# EAGLE board robot_PI4_F28379D (EAGLE 7.7.0), part 1 of 2
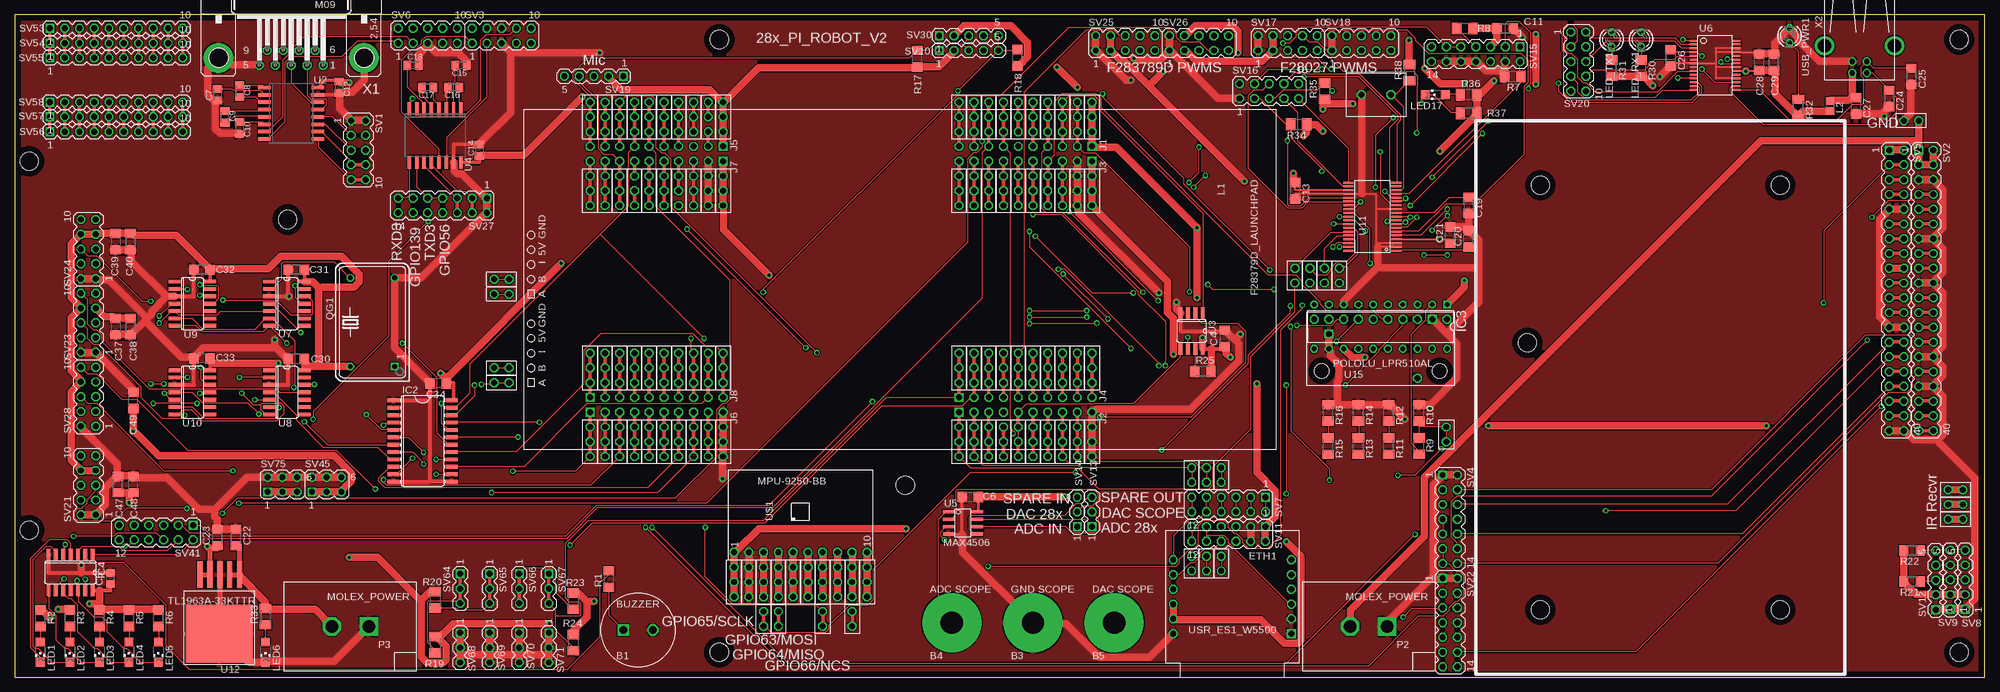
[diagram p6: board, top side]
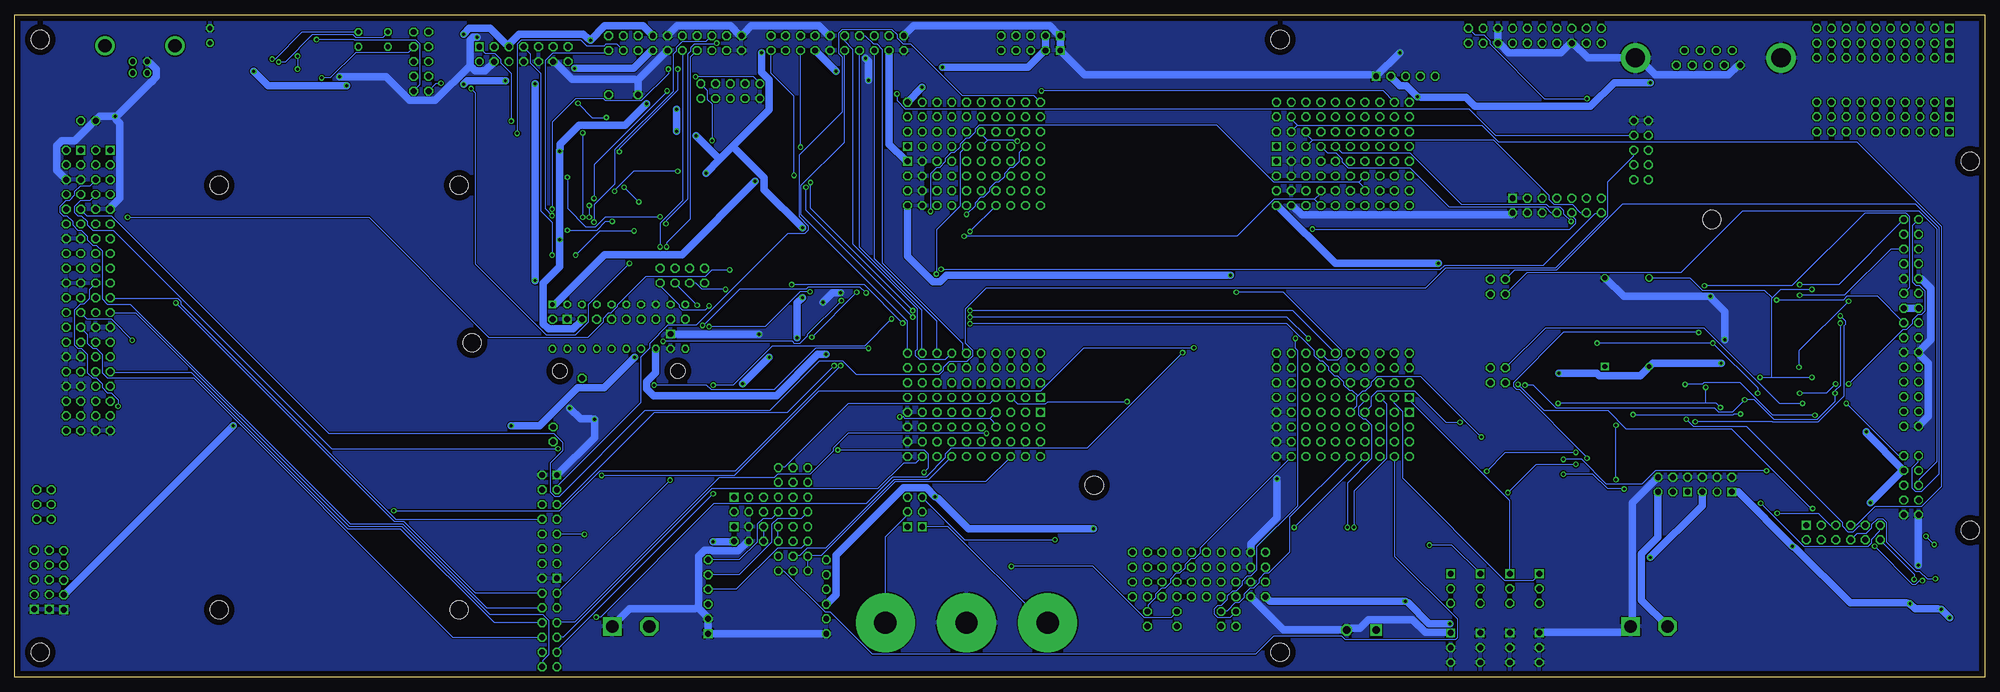
[diagram p7: board, bottom side, seen from below]

Size 339.07 x 113.97 mm. Coordinates in mm from the lower left corner, seen from the top.
Outline: 0,0 339.07,0 339.07,113.97 0,113.97 0,0
Copper layers (1*16): Top 0.035mm / dielectric 1.5mm / Bottom 0.035mm
Design rules "default *": minimum track width 8mil, minimum drill 20mil, track to track 8mil, track to pad 8mil, pad to pad 8mil, via to via 8mil, smd to smd 8mil, copper to edge 40mil, drill to drill 8mil, minimum pad ring 10mil, minimum via ring 8mil, stop-mask expansion 4mil, vias tented up to drill 20mil, thermal gap 10mil
Net classes: 0 default: width 0.203 mm, drill 0.508 mm, clearance 0.203 mm; 1 supply: width 1.27 mm, drill 0.508 mm, clearance 0.203 mm
Holes 3.17 mm at 121.28,4.28 334.64,4.28 334.64,109.69 121.28,109.69 2.53,88.73 2.53,25.23 46.98,78.7 260.34,57.49 153.28,32.98 262.57,84.61 303.84,84.61 303.84,11.58 262.57,11.58

## Footprints (pad centres in the part's own frame; a part is rotated, then mirrored left to right if it is on the bottom)
BUZZER = drill 1.27 square: P$1 -2.54,0 | drill 1.27 octagon: P$2 2.54,0
BANANA_MALE = drill 3.81 pad 10.16: P$1 0,0
C1206 = smd 1.6 x 1.8: 1 -1.4,0; 2 1.4,0
C0805 = smd 1.3 x 1.5: 1 -0.95,0; 2 0.95,0
C0805K = smd 1.3 x 1.6: 1 -1,0; 2 1,0
USR_ES1_W5500 = drill 1.016 square: P$1 0,0 | drill 1.016 octagon: P$2 0,-2.54; P$3 0,-5.08; P$4 0,-7.62; P$5 0,-10.16; P$6 0,-12.7; P$7 20.32,-12.7; P$8 20.32,-10.16; P$9 20.32,-7.62; P$10 20.32,-5.08; P$11 20.32,-2.54; P$12 20.32,0
SO24W = smd 0.66 x 2.032: 1 -6.985,-5.029; 2 -5.715,-5.029; 3 -4.445,-5.029; 4 -3.175,-5.029; 5 -1.905,-5.029; 6 -0.635,-5.029; 7 0.635,-5.029; 8 1.905,-5.029; 9 3.175,-5.029; 10 4.445,-5.029; 11 5.715,-5.029; 12 6.985,-5.029; 13 6.985,5.029; 14 5.715,5.029; 15 4.445,5.029; 16 3.175,5.029; 17 1.905,5.029; 18 0.635,5.029; 19 -0.635,5.029; 20 -1.905,5.029; 21 -3.175,5.029; 22 -4.445,5.029; 23 -5.715,5.029; 24 -6.985,5.029
DIL20 = drill 0.813 square: 1 -11.43,-3.81 | drill 0.813 octagon: 2 -8.89,-3.81; 3 -6.35,-3.81; 4 -3.81,-3.81; 5 -1.27,-3.81; 6 1.27,-3.81; 7 3.81,-3.81; 8 6.35,-3.81; 9 8.89,-3.81; 10 11.43,-3.81; 11 11.43,3.81; 12 8.89,3.81; 13 6.35,3.81; 14 3.81,3.81; 15 1.27,3.81; 16 -1.27,3.81; 17 -3.81,3.81; 18 -6.35,3.81; 19 -8.89,3.81; 20 -11.43,3.81
SO14 = smd 0.66 x 2.032: 1 -3.81,-3.073; 2 -2.54,-3.073; 3 -1.27,-3.073; 4 0,-3.073; 5 1.27,-3.073; 6 2.54,-3.073; 7 3.81,-3.073; 8 3.81,3.073; 9 2.54,3.073; 10 1.27,3.073; 11 0,3.073; 12 -1.27,3.073; 13 -2.54,3.073; 14 -3.81,3.073
STRIP2 = drill 1.016 octagon: P$1 0,0; P$2 2.54,0
STRIP3 = drill 1.016 octagon: P$1 0,0; P$2 2.54,0; P$3 5.08,0
F28379D_LAUNCHPAD = drill 1.016 square: P$1 -24.13,33.02; P$11 21.59,10.16; P$21 -21.59,33.02; P$31 19.05,10.16; P$41 -24.13,-30.48; P$51 21.59,-53.34; P$61 -21.59,-30.48; P$71 19.05,-53.34 | drill 1.016 octagon: P$2 -24.13,30.48; P$3 -24.13,27.94; P$4 -24.13,25.4; P$5 -24.13,22.86; P$6 -24.13,20.32; P$7 -24.13,17.78; P$8 -24.13,15.24; P$9 -24.13,12.7; P$10 -24.13,10.16; P$12 21.59,12.7; P$13 21.59,15.24; P$14 21.59,17.78; P$15 21.59,20.32; P$16 21.59,22.86; P$17 21.59,25.4; P$18 21.59,27.94; P$19 21.59,30.48; P$20 21.59,33.02; P$22 -21.59,30.48; P$23 -21.59,27.94; P$24 -21.59,25.4; P$25 -21.59,22.86; P$26 -21.59,20.32; P$27 -21.59,17.78; P$28 -21.59,15.24; P$29 -21.59,12.7; P$30 -21.59,10.16; P$32 19.05,12.7; P$33 19.05,15.24; P$34 19.05,17.78; P$35 19.05,20.32; P$36 19.05,22.86; P$37 19.05,25.4; P$38 19.05,27.94; P$39 19.05,30.48; P$40 19.05,33.02; P$42 -24.13,-33.02; P$43 -24.13,-35.56; P$44 -24.13,-38.1; P$45 -24.13,-40.64; P$46 -24.13,-43.18; P$47 -24.13,-45.72; P$48 -24.13,-48.26; P$49 -24.13,-50.8; P$50 -24.13,-53.34; P$52 21.59,-50.8; P$53 21.59,-48.26; P$54 21.59,-45.72; P$55 21.59,-43.18; P$56 21.59,-40.64; P$57 21.59,-38.1; P$58 21.59,-35.56; P$59 21.59,-33.02; P$60 21.59,-30.48; P$62 -21.59,-33.02; P$63 -21.59,-35.56; P$64 -21.59,-38.1; P$65 -21.59,-40.64; P$66 -21.59,-43.18; P$67 -21.59,-45.72; P$68 -21.59,-48.26; P$69 -21.59,-50.8; P$70 -21.59,-53.34; P$72 19.05,-50.8; P$73 19.05,-48.26; P$74 19.05,-45.72; P$75 19.05,-43.18; P$76 19.05,-40.64; P$77 19.05,-38.1; P$78 19.05,-35.56; P$79 19.05,-33.02; P$80 19.05,-30.48
L0805 = smd 1.3 x 1.5: 1 -0.85,0; 2 0.85,0
CHIPLED_1206 = smd 1.5 x 1.5: A 0,-1.75; C 0,1.75
LED3MM = drill 0.813 octagon: A -1.27,0; K 1.27,0
TH_PUSHBUTTON = drill 1.016 octagon: 1 0,2.54; 2 0,-2.54
MOLEX_POWER = drill 2.159 square: P$1 0,0 | drill 2.159 octagon: P$2 6.35,0
DIL14S = drill 0.813 square: 1 -7.62,-3.81 | drill 0.813: 7 7.62,-3.81; 8 7.62,3.81; 14 -7.62,3.81
R1206 = smd 1.6 x 1.803: 1 -1.422,0; 2 1.422,0
M1206 = smd 1.6 x 2: 1 -1.4,0; 2 1.4,0
MA05-2 = drill 1.016 octagon: 1 -5.08,-1.27; 2 -5.08,1.27; 3 -2.54,-1.27; 4 -2.54,1.27; 5 0,-1.27; 6 0,1.27; 7 2.54,-1.27; 8 2.54,1.27; 9 5.08,-1.27; 10 5.08,1.27
MA20-2 = drill 1.016 square: 1 -24.13,-1.27 | drill 1.016 octagon: 2 -24.13,1.27; 3 -21.59,-1.27; 4 -21.59,1.27; 5 -19.05,-1.27; 6 -19.05,1.27; 7 -16.51,-1.27; 8 -16.51,1.27; 9 -13.97,-1.27; 10 -13.97,1.27; 11 -11.43,-1.27; 12 -11.43,1.27; 13 -8.89,-1.27; 14 -8.89,1.27; 15 -6.35,-1.27; 16 -6.35,1.27; 17 -3.81,-1.27; 18 -3.81,1.27; 19 -1.27,-1.27; 20 -1.27,1.27; 21 1.27,-1.27; 22 1.27,1.27; 23 3.81,-1.27; 24 3.81,1.27; 25 6.35,-1.27; 26 6.35,1.27; 27 8.89,-1.27; 28 8.89,1.27; 29 11.43,-1.27; 30 11.43,1.27; 31 13.97,-1.27; 32 13.97,1.27; 33 16.51,-1.27; 34 16.51,1.27; 35 19.05,-1.27; 36 19.05,1.27; 37 21.59,-1.27; 38 21.59,1.27; 39 24.13,-1.27; 40 24.13,1.27
MA07-2 = drill 1.016 square: 1 -7.62,-1.27 | drill 1.016 octagon: 2 -7.62,1.27; 3 -5.08,-1.27; 4 -5.08,1.27; 5 -2.54,-1.27; 6 -2.54,1.27; 7 0,-1.27; 8 0,1.27; 9 2.54,-1.27; 10 2.54,1.27; 11 5.08,-1.27; 12 5.08,1.27; 13 7.62,-1.27; 14 7.62,1.27
MA06-2 = drill 1.016 square: 1 -6.35,-1.27 | drill 1.016 octagon: 2 -6.35,1.27; 3 -3.81,-1.27; 4 -3.81,1.27; 5 -1.27,-1.27; 6 -1.27,1.27; 7 1.27,-1.27; 8 1.27,1.27; 9 3.81,-1.27; 10 3.81,1.27; 11 6.35,-1.27; 12 6.35,1.27
MA05-1 = drill 1.016 square: 1 -5.08,0 | drill 1.016 octagon: 2 -2.54,0; 3 0,0; 4 2.54,0; 5 5.08,0
MA03-1 = drill 1.016 square: 1 -2.54,0 | drill 1.016 octagon: 2 0,0; 3 2.54,0
MA03-2 = drill 1.016 square: 1 -2.54,-1.27 | drill 1.016 octagon: 2 -2.54,1.27; 3 0,-1.27; 4 0,1.27; 5 2.54,-1.27; 6 2.54,1.27
MA10-1 = drill 1.016 square: 1 -11.43,0 | drill 1.016 octagon: 2 -8.89,0; 3 -6.35,0; 4 -3.81,0; 5 -1.27,0; 6 1.27,0; 7 3.81,0; 8 6.35,0; 9 8.89,0; 10 11.43,0
SO16W = smd 0.6 x 2.2: 1 -4.445,-4.6; 2 -3.175,-4.6; 3 -1.905,-4.6; 4 -0.635,-4.6; 5 0.635,-4.6; 6 1.905,-4.6; 7 3.175,-4.6; 8 4.445,-4.6; 9 4.445,4.6; 10 3.175,4.6; 11 1.905,4.6; 12 0.635,4.6; 13 -0.635,4.6; 14 -1.905,4.6; 15 -3.175,4.6; 16 -4.445,4.6
SO08 = smd 0.66 x 2.032: 1 -1.905,-3.073; 2 -0.635,-3.073; 3 0.635,-3.073; 4 1.905,-3.073; 5 1.905,3.073; 6 0.635,3.073; 7 -0.635,3.073; 8 -1.905,3.073
SOIC-8 = smd 1.98 x 0.53: P$1 -2.465,1.905; P$2 -2.465,0.635; P$3 -2.465,-0.635; P$4 -2.465,-1.905; P$5 2.465,-1.905; P$6 2.465,-0.635; P$7 2.465,0.635; P$8 2.465,1.905
SSOP28DB = smd 0.348 x 1.397: 1 -4.225,-3.656; 2 -3.575,-3.656; 3 -2.925,-3.656; 4 -2.275,-3.656; 5 -1.625,-3.656; 6 -0.975,-3.656; 7 -0.325,-3.656; 8 0.325,-3.656; 9 0.975,-3.656; 10 1.625,-3.656; 11 2.275,-3.656; 12 2.925,-3.656; 13 3.575,-3.656; 14 4.225,-3.656; 15 4.225,3.656; 16 3.575,3.656; 17 2.925,3.656; 18 2.275,3.656; 19 1.625,3.656; 20 0.975,3.656; 21 0.325,3.656; 22 -0.325,3.656; 23 -0.975,3.656; 24 -1.625,3.656; 25 -2.275,3.656; 26 -2.925,3.656; 27 -3.575,3.656; 28 -4.225,3.656
DA38 = smd 0.35 x 1.705: 1 -5.85,-4.12; 2 -5.2,-4.12; 3 -4.55,-4.12; 4 -3.9,-4.12; 5 -3.25,-4.12; 6 -2.6,-4.12; 7 -1.95,-4.12; 8 -1.3,-4.12; 9 -0.65,-4.12; 10 0,-4.12; 11 0.65,-4.12; 12 1.3,-4.12; 13 1.95,-4.12; 14 2.6,-4.12; 15 3.25,-4.12; 16 3.9,-4.12; 17 4.55,-4.12; 18 5.2,-4.12; 19 5.85,-4.12; 20 5.85,4.12; 21 5.2,4.12; 22 4.55,4.12; 23 3.9,4.12; 24 3.25,4.12; 25 2.6,4.12; 26 1.95,4.12; 27 1.3,4.12; 28 0.65,4.12; 29 0,4.12; 30 -0.65,4.12; 31 -1.3,4.12; 32 -1.95,4.12; 33 -2.6,4.12; 34 -3.25,4.12; 35 -3.9,4.12; 36 -4.55,4.12; 37 -5.2,4.12; 38 -5.85,4.12
TL1963AKTTR = smd 0.914 x 4.572: P$1 -3.81,-10.16; P$2 -2.108,-10.16; P$3 -0.406,-10.16; P$4 1.295,-10.16; P$5 2.997,-10.16 | smd 11.5 x 10: P$6 -0.3,0
POLOLU_LPR510AL = drill 1.016 octagon: P$1 0,0; P$3 0,-5.08; P$4 0,-7.62; P$5 0,-10.16; P$6 0,-12.7; P$7 0,-15.24; P$8 0,-17.78; P$9 0,-20.32; P$10 0,-22.86; P$12 10.16,-5.08 | drill 1.016 square: P$2 0,-2.54; P$11 2.54,-20.32 | hole 2.54: 8.89,-1.27; 8.89,-21.59
MPU-9250-BB = drill 1.016 octagon: 1 -11.434,-6.96; 2 -8.894,-6.96; 3 -6.354,-6.96; 4 -3.814,-6.96; 5 -1.274,-6.96; 6 1.266,-6.96; 7 3.806,-6.96; 8 6.346,-6.96; 9 8.886,-6.96; 10 11.426,-6.96
M09HP = drill 1.016 octagon: 1 -5.486,1.27; 2 -2.743,1.27; 3 0,1.27; 4 2.743,1.27; 5 5.486,1.27; 6 -4.115,-1.27; 7 -1.372,-1.27; 8 1.372,-1.27; 9 4.115,-1.27 | drill 3.302 pad 5.08: G1 -12.522,0; G2 12.522,0
USB-B-H = drill 0.914: D+ 0,1.25; D- 1.981,1.25; GND 0,-1.25; VBUS 1.981,-1.25 | drill 2.286: P$1 -2.718,-6.02; P$2 -2.718,6.02

## Placement (x,y rotation side)
B1  BUZZER  [BUZZER]  107.31,8.09 0 top
B3  GND SCOPE  [BANANA_MALE]  175.25,9.36 0 top
B4  ADC SCOPE  [BANANA_MALE]  161.28,9.36 0 top
B5  DAC SCOPE  [BANANA_MALE]  189.22,9.36 0 top
C4  0.1uf  [C1206]  208.27,58.26 90 top
C5  0.1uF  [C0805]  16.5,16.98 90 top
C6  0.1uf  [C1206]  164.46,30.95 180 top
C7  0.1uF  [C0805K]  34.92,100.16 90 top
C8  0.1uF  [C0805K]  38.73,100.8 270 top
C9  0.1uF  [C0805K]  36.19,96.35 270 top
C10  0.1uF  [C0805K]  38.73,94.45 270 top
C11  0.1 uF  [C1206]  256.53,111.59 0 top
C12  0.1uF  [C0805K]  55.87,101.43 270 top
C13  2.2 uF  [C1206]  220.34,83.65 270 top
C14  0.1uF  [C0805K]  80,90.64 90 top
C15  0.1uF  [C0805K]  76.83,105.24 180 top
C16  0.1uF  [C0805K]  75.56,101.43 180 top
C17  0.1uF  [C0805K]  71.11,101.43 180 top
C18  0.1uF  [C0805K]  68.57,105.24 0 top
C19  2.2 uF  [C1206]  250.19,81.11 270 top
C20  2.2 uF  [C1206]  250.19,75.4 90 top
C21  2.2 uF  [C1206]  247.01,76.03 90 top
C22  10 uF  [C1206]  38.09,23.96 90 top
C23  10 uF  [C1206]  34.92,23.96 90 top
C24  47pF  [C1206]  322.57,99.53 270 top
C25  47pF  [C1206]  326.38,103.34 270 top
C26  0.1uF  [C1206]  284.98,106.52 270 top
C27  10nF  [C1206]  316.86,98.26 270 top
C28  0.1uF  [C1206]  300.22,105.75 90 top
C29  4.7uF  [C1206]  302.76,105.75 90 top
C30  0.1uF  [C1206]  48.51,54.7 180 top
C31  0.1uF  [C1206]  48.51,70.07 180 top
C32  0.1uF  [C1206]  32.25,70.07 180 top
C33  0.1uF  [C1206]  32.25,54.83 180 top
C34  0.1uF  [C1206]  72.89,50.51 180 top
C37  0.1uF  [C1206]  17.39,60.29 270 top
C38  0.1uF  [C1206]  19.93,60.29 270 top
C39  0.1uF  [C1206]  17.39,74.89 270 top
C40  0.1uF  [C1206]  19.93,74.89 270 top
C47  0.1uF  [C1206]  17.77,33.11 90 top
C48  0.1uF  [C1206]  20.44,33.11 90 top
C49  0.1uF  [C1206]  20.44,47.59 90 top
ETH1  USR_ES1_W5500  [USR_ES1_W5500]  219.7,7.46 180 top
IC2  743384DW  [SO24W]  70.23,40.6 270 top
IC3  ADXRS300EB  [DIL20]  235.07,60.29 180 top
IC4  74ALS04D  [SO14]  9.65,18 180 top
J1  STRIP2  [STRIP2]  246.38,43.02 270 top
J2  STRIP2  [STRIP2]  82.54,65.88 0 top
J3  STRIP2  [STRIP2]  82.54,50.63 0 top
J5  STRIP2  [STRIP2]  82.54,68.41 0 top
J6  STRIP2  [STRIP2]  82.54,53.18 0 top
J7  STRIP2  [STRIP2]  325.12,95.72 0 top
J9  STRIP2  [STRIP2]  207.64,36.03 270 top
J10  STRIP3  [STRIP3]  185.41,93.81 90 top
J11  STRIP2  [STRIP2]  207.64,20.79 270 top
J12  STRIP2  [STRIP2]  332.74,27.14 0 top
J13  STRIP2  [STRIP2]  332.74,29.68 0 top
J14  STRIP3  [STRIP3]  182.88,93.81 90 top
J15  STRIP3  [STRIP3]  180.33,93.81 90 top
J16  STRIP3  [STRIP3]  177.79,93.81 90 top
J17  STRIP3  [STRIP3]  175.25,93.81 90 top
J18  STRIP3  [STRIP3]  172.72,98.89 270 top
J19  STRIP3  [STRIP3]  170.18,98.89 270 top
J20  STRIP3  [STRIP3]  167.63,93.81 90 top
J21  STRIP3  [STRIP3]  165.09,98.89 270 top
J22  STRIP2  [STRIP2]  332.74,32.22 0 top
J28  STRIP3  [STRIP3]  162.56,93.81 90 top
J29  STRIP3  [STRIP3]  162.56,37.94 90 top
J30  STRIP3  [STRIP3]  165.09,37.94 90 top
J31  STRIP3  [STRIP3]  167.63,37.94 90 top
J32  STRIP3  [STRIP3]  170.18,37.94 90 top
J33  STRIP3  [STRIP3]  172.72,37.94 90 top
J35  STRIP2  [STRIP2]  225.42,70.32 270 top
J36  STRIP2  [STRIP2]  222.88,70.32 270 top
J37  STRIP2  [STRIP2]  220.34,70.32 270 top
J38  STRIP2  [STRIP2]  227.96,70.32 270 top
J66  STRIP2  [STRIP2]  205.1,20.79 270 top
J67  STRIP2  [STRIP2]  205.1,36.03 270 top
J68  STRIP2  [STRIP2]  202.56,20.79 270 top
J69  STRIP2  [STRIP2]  202.56,36.03 270 top
J98  STRIP3  [STRIP3]  175.25,37.94 90 top
J99  STRIP3  [STRIP3]  177.79,37.94 90 top
J100  STRIP3  [STRIP3]  180.33,37.94 90 top
J101  STRIP3  [STRIP3]  182.88,37.94 90 top
J102  STRIP3  [STRIP3]  185.41,37.94 90 top
J103  STRIP3  [STRIP3]  185.41,81.11 90 top
J104  STRIP3  [STRIP3]  182.88,81.11 90 top
J105  STRIP3  [STRIP3]  180.33,81.11 90 top
J106  STRIP3  [STRIP3]  177.79,81.11 90 top
J107  STRIP3  [STRIP3]  175.25,81.11 90 top
J108  STRIP3  [STRIP3]  172.72,81.11 90 top
J109  STRIP3  [STRIP3]  170.18,81.11 90 top
J110  STRIP3  [STRIP3]  167.63,81.11 90 top
J111  STRIP3  [STRIP3]  165.09,81.11 90 top
J112  STRIP3  [STRIP3]  162.56,81.11 90 top
J113  STRIP3  [STRIP3]  162.56,50.63 90 top
J114  STRIP3  [STRIP3]  165.09,50.63 90 top
J115  STRIP3  [STRIP3]  167.63,50.63 90 top
J116  STRIP3  [STRIP3]  170.18,50.63 90 top
J117  STRIP3  [STRIP3]  172.72,50.63 90 top
J118  STRIP3  [STRIP3]  175.25,50.63 90 top
J119  STRIP3  [STRIP3]  177.79,50.63 90 top
J120  STRIP3  [STRIP3]  180.33,50.63 90 top
J121  STRIP3  [STRIP3]  182.88,50.63 90 top
J122  STRIP3  [STRIP3]  185.41,50.63 90 top
J123  STRIP3  [STRIP3]  123.82,18.89 270 top
J124  STRIP3  [STRIP3]  126.36,18.89 270 top
J125  STRIP3  [STRIP3]  128.9,18.89 270 top
J126  STRIP3  [STRIP3]  131.44,18.89 270 top
J127  STRIP3  [STRIP3]  133.98,18.89 270 top
J128  STRIP3  [STRIP3]  136.52,18.89 270 top
J129  STRIP3  [STRIP3]  139.06,18.89 270 top
J130  STRIP3  [STRIP3]  141.6,18.89 270 top
J131  STRIP3  [STRIP3]  144.14,18.89 270 top
J132  STRIP3  [STRIP3]  146.68,18.89 270 top
J133  STRIP3  [STRIP3]  121.91,50.63 90 top
J134  STRIP3  [STRIP3]  119.38,50.63 90 top
J135  STRIP3  [STRIP3]  116.83,50.63 90 top
J136  STRIP3  [STRIP3]  114.29,50.63 90 top
J137  STRIP3  [STRIP3]  111.75,50.63 90 top
J138  STRIP3  [STRIP3]  109.21,50.63 90 top
J139  STRIP3  [STRIP3]  106.67,50.63 90 top
J140  STRIP3  [STRIP3]  104.13,50.63 90 top
J141  STRIP3  [STRIP3]  101.59,50.63 90 top
J142  STRIP3  [STRIP3]  99.05,50.63 90 top
J143  STRIP3  [STRIP3]  99.05,86.19 270 top
J144  STRIP3  [STRIP3]  101.59,86.19 270 top
J145  STRIP3  [STRIP3]  104.13,86.19 270 top
J146  STRIP3  [STRIP3]  106.67,86.19 270 top
J147  STRIP3  [STRIP3]  109.21,86.19 270 top
J148  STRIP3  [STRIP3]  111.75,86.19 270 top
J149  STRIP3  [STRIP3]  114.29,86.19 270 top
J150  STRIP3  [STRIP3]  116.83,86.19 270 top
J151  STRIP3  [STRIP3]  119.38,86.19 270 top
J152  STRIP3  [STRIP3]  121.91,86.19 270 top
J153  STRIP3  [STRIP3]  121.91,43.02 270 top
J154  STRIP3  [STRIP3]  119.38,43.02 270 top
J155  STRIP3  [STRIP3]  116.83,43.02 270 top
J156  STRIP3  [STRIP3]  114.29,43.02 270 top
J157  STRIP3  [STRIP3]  111.75,43.02 270 top
J158  STRIP3  [STRIP3]  109.21,43.02 270 top
J159  STRIP3  [STRIP3]  106.67,43.02 270 top
J160  STRIP3  [STRIP3]  104.13,43.02 270 top
J161  STRIP3  [STRIP3]  101.59,43.02 270 top
J162  STRIP3  [STRIP3]  99.05,43.02 270 top
J163  STRIP3  [STRIP3]  99.05,93.81 90 top
J164  STRIP3  [STRIP3]  101.59,93.81 90 top
J165  STRIP3  [STRIP3]  104.13,93.81 90 top
J166  STRIP3  [STRIP3]  106.67,93.81 90 top
J167  STRIP3  [STRIP3]  109.21,93.81 90 top
J168  STRIP3  [STRIP3]  111.75,93.81 90 top
J169  STRIP3  [STRIP3]  114.29,93.81 90 top
J170  STRIP3  [STRIP3]  116.83,93.81 90 top
J176  STRIP3  [STRIP3]  119.38,93.81 90 top
J177  STRIP3  [STRIP3]  121.91,93.81 90 top
J204  STRIP2  [STRIP2]  131.44,11.27 270 top
J205  STRIP2  [STRIP2]  139.06,11.27 270 top
J206  STRIP2  [STRIP2]  128.9,11.27 270 top
J207  STRIP2  [STRIP2]  144.14,11.27 270 top
L1  F28379D_LAUNCHPAD  [F28379D_LAUNCHPAD]  152.39,67.14 270 top
L2  BLM21PG221SN1D  [L0805]  312.42,98.26 270 top
LED1  [CHIPLED_1206]  4.44,4.28 180 top
LED2  [CHIPLED_1206]  9.52,4.28 180 top
LED3  [CHIPLED_1206]  14.6,4.28 180 top
LED4  [CHIPLED_1206]  19.68,4.28 180 top
LED5  [CHIPLED_1206]  24.76,4.28 180 top
LED6  [CHIPLED_1206]  43.17,4.28 180 top
LED17  [CHIPLED_1206]  244.47,100.16 90 top
LED_RX1  [LED3MM]  279.9,109.69 90 top
LED_TX1  [LED3MM]  274.82,109.69 90 top
P1  [TH_PUSHBUTTON]  234.31,100.16 270 top
P2  MOLEX_POWER  [MOLEX_POWER]  236.21,8.73 180 top
P3  MOLEX_POWER  [MOLEX_POWER]  60.95,8.73 180 top
QG1  [DIL14S]  61.59,61.05 90 top
R1  100  [R1206]  102.23,16.85 90 top
R2  1K  [R1206]  4.44,10.12 270 top
R3  1K  [R1206]  9.52,10.12 270 top
R4  1K  [R1206]  14.6,10.12 270 top
R5  1K  [R1206]  19.68,10.12 270 top
R6  1K  [R1206]  24.76,10.12 270 top
R7  4.7K  [M1206]  257.81,103.34 180 top
R8  4.7K  [M1206]  249.55,111.59 180 top
R9  1.7x  [M1206]  241.68,39.71 270 top
R10  3.3x  [M1206]  241.68,45.43 270 top
R11  1.7x  [M1206]  236.47,39.71 270 top
R12  3.3x  [M1206]  236.47,45.43 270 top
R13  1.7x  [M1206]  231.26,39.71 270 top
R14  3.3x  [M1206]  231.26,45.43 270 top
R15  1.7x  [M1206]  226.06,39.71 270 top
R16  3.3x  [M1206]  226.06,45.43 270 top
R17  [R1206]  155.32,106.39 270 top
R18  [R1206]  172.59,106.52 270 top
R19  10K  [M1206]  72.38,5.55 90 top
R20  10K  [M1206]  72.38,13.3 90 top
R21  [R1206]  326.51,16.47 180 top
R22  [R1206]  326.51,21.81 180 top
R23  10k  [M1206]  96.13,13.04 90 top
R24  10K  [M1206]  96.13,5.93 90 top
R25  10K  [M1206]  204.46,52.54 0 top
R30  470  [M1206]  279.9,104.74 270 top
R31  470  [M1206]  274.82,104.74 270 top
R32  470  [M1206]  306.95,98.01 270 top
R33  470  [M1206]  43.17,10.38 90 top
R34  4.7k  [M1206]  220.97,95.08 180 top
R35  4.7k  [M1206]  225.42,100.8 90 top
R36  1K  [M1206]  250.19,100.16 0 top
R37  4.7k  [M1206]  250.19,96.99 0 top
R38  4.7k  [M1206]  240.02,103.97 90 top
SV1  [MA05-2]  59.18,90.64 270 top
SV2  [MA20-2]  328.93,66.51 270 top
SV3  [MA05-2]  83.81,110.32 0 top
SV4  [MA07-2]  247.01,27.14 270 top
SV5  [MA20-2]  323.84,66.51 270 top
SV6  [MA05-2]  71.11,110.32 0 top
SV7  [MA06-2]  208.91,29.68 180 top
SV8  [MA05-1]  335.66,16.73 90 top
SV9  [MA05-1]  333.12,16.73 90 top
SV10  [MA05-1]  164.21,107.78 0 top
SV11  [MA06-2]  208.91,24.6 180 top
SV12  [MA05-1]  330.59,16.66 90 top
SV13  [MA03-1]  185.41,28.41 90 top
SV14  [MA03-1]  182.88,28.41 90 top
SV15  [MA07-2]  251.45,107.15 180 top
SV16  [MA05-2]  215.89,100.8 0 top
SV17  [MA05-2]  219.07,109.05 0 top
SV18  [MA05-2]  231.77,109.05 0 top
SV19  [MA05-1]  99.69,103.34 180 top
SV20  [MA05-2]  269.11,105.88 270 top
SV21  [MA05-2]  12.69,32.98 90 top
SV22  [MA07-2]  247.01,9.36 270 top
SV23  [MA05-2]  12.69,60.92 90 top
SV24  [MA05-2]  12.69,73.62 90 top
SV25  [MA05-2]  191.13,109.05 0 top
SV26  [MA05-2]  203.83,109.05 0 top
SV27  [MA07-2]  73.66,81.11 180 top
SV28  [MA05-2]  12.69,48.22 90 top
SV30  [MA05-1]  164.21,110.32 0 top
SV41  [MA06-2]  24.38,24.85 180 top
SV45  [MA03-2]  53.72,33.11 0 top
SV53  [MA10-1]  17.52,111.59 0 top
SV54  [MA10-1]  17.52,109.05 0 top
SV55  [MA10-1]  17.52,106.52 0 top
SV56  [MA10-1]  17.52,93.81 0 top
SV57  [MA10-1]  17.52,96.35 0 top
SV58  [MA10-1]  17.52,98.89 0 top
SV64  [MA03-1]  76.7,15.2 270 top
SV65  [MA03-1]  81.78,15.2 270 top
SV66  [MA03-1]  86.86,15.2 270 top
SV67  [MA03-1]  91.94,15.2 270 top
SV68  [MA03-1]  76.7,5.04 270 top
SV69  [MA03-1]  81.78,5.04 270 top
SV70  [MA03-1]  86.86,5.04 270 top
SV71  [MA03-1]  91.94,5.04 270 top
SV75  [MA03-2]  46.1,33.11 0 top
U2  MAX3232IDWR  [SO16W]  47.62,96.99 270 top
U3  IS62WVS512  [SO08]  202.56,59.52 180 top
U4  MAX3232IDWR  [SO16W]  72.38,93.18 180 top
U5  MAX4506  [SOIC-8]  163.19,26.51 0 top
U6  FT232RL  [SSOP28DB]  292.6,105.24 270 top
U7  [SO14]  46.86,64.22 270 top
U8  [SO14]  46.86,48.98 270 top
U9  LS7366  [SO14]  30.6,64.22 270 top
U10  LS7366  [SO14]  30.6,48.98 270 top
U11  F28027  [DA38]  233.68,79.21 90 top
U12  TL1963A-33KTTR  [TL1963AKTTR]  34.92,7.46 180 top
U15  POLOLU_LPR510AL  [POLOLU_LPR510AL]  246.5,61.56 270 top
U$1  MPU-9250-BB  [MPU-9250-BB]  135.25,28.41 0 top
USB_PWR1  [LED3MM]  305.43,110.32 90 top
X1  [M09HP]  47.62,106.52 180 top
X2  [USB-B-H]  317.5,105.88 270 top

## Tracks (layer width: path | path; a pad name or v marks a point on that pad's centre or on a via)
28027_GPIO0  (via drill 0.51)
  Top 0.203: v227.99,74 229.51,74 U11.37
  Bottom 0.203: v227.99,74 227.99,78.07 224.12,81.93 224.12,107.73 SV17.9
28027_GPIO1  (via drill 0.51)
  Top 0.203: v226.87,74 227.68,74.82 228.29,74.82 228.39,74.71 229.51,74.71 U11.36
  Bottom 0.203: v226.87,74 226.87,74.71 222.8,78.78 222.8,106.62 221.69,107.73 SV17.7
28027_GPIO2  (via drill 0.51)
  Top 0.203: v246.58,80.5 246.48,80.5 242.01,76.03 237.84,76.03 U11.5 | v226.56,104.58 226.06,104.58 223.92,106.72 220.16,106.72 219.15,107.73 SV17.5
  Bottom 0.203: v246.58,80.5 246.58,95.44 242.51,99.5 237.74,99.5 237.33,99.1 231.24,99.1 226.56,103.77 v226.56,104.58
28027_GPIO3
  Top 0.203: U11.6 237.84,76.64 241.6,76.64 246.27,81.32 251.15,81.32 259.69,89.85 259.69,101.54 260.4,102.25 260.4,106.11 259.18,107.33 243.33,107.33 240.99,109.66 240.99,109.97 239.57,111.39 225.24,111.39 224.23,110.38 SV17.10
28027_GPIO4  (via drill 0.51)
  Top 0.203: v241.29,79.08 239.57,77.36 237.84,77.36 U11.7 | v241.29,93.61 241.29,101.54 241.4,101.64 241.4,103.47 240.69,104.18 228.7,104.18 225.24,107.63 225.24,108.24 224.23,109.26 222.7,109.26 221.69,110.27 SV17.8
  Bottom 0.203: v241.29,93.61 v241.29,79.08
28027_GPIO5  (via drill 0.51)
  Top 0.203: v239.37,78.27 239.06,77.96 237.84,77.96 U11.8
  Bottom 0.203: v239.37,78.27 239.37,81.22 235.81,84.77 235.81,90.66 225.75,100.72 225.75,107.12 225.24,107.63 225.24,108.24 224.23,109.26 220.16,109.26 219.15,110.27 SV17.6
28027_GPIO6  (via drill 0.51)
  Top 0.203: v236.21,78.37 236.32,78.47 237.74,78.47 U11.9 | v243.94,76.85 246.48,79.39 v246.58,79.39
  Bottom 0.203: v236.21,78.37 237.33,78.37 238.86,76.85 v243.94,76.85 | v246.58,79.39 247.8,80.61 247.8,106.01 246.48,107.33 237.33,107.33 236.93,107.73 SV18.9
28027_GPIO7  (via drill 0.51)
  Top 0.203: v240.18,79.08 240.08,79.18 237.84,79.18 U11.10 | v252.57,93.51 v240.18,81.11
  Bottom 0.203: v240.18,81.11 v240.18,79.08 | v252.57,93.51 252.57,108.85 251.86,109.56 241.6,109.56 240.58,108.55 237.64,108.55 237.33,108.85 235.4,108.85 234.39,107.84 SV18.7
28027_GPIO12  (via drill 0.51)
  Top 0.203: v235,90.36 235,83.15 236.93,81.22 237.74,81.22 U11.13 | v224.94,104.58 215.79,104.58 213.35,102.15 SV16.4
  Bottom 0.203: v235,90.36 235,90.87 224.94,100.93 v224.94,104.58
28027_GPIO34  (via drill 0.51)
  Top 0.203: R37.1 248.71,97.07 247.29,97.07 244.24,100.11 242.82,100.11 LED17.C 242.82,100.01 242.11,99.3 v242.11,98.69 | v231.64,81.72 230.52,80.61 229.61,80.61 U11.27 | v234.18,84.27 234.18,93.2 v237.23,96.25
  Bottom 0.203: v234.18,84.27 v231.64,81.72 | v237.23,96.25 239.67,96.25 v242.11,98.69
28027_SCL  (via drill 0.51)
  Top 0.203: v235.81,83.55 236.82,82.54 237.74,82.54 U11.15 | v224.94,87.01 224.94,87.52 219.65,92.8 219.65,95.03 R34.2 219.55,95.14 218.74,95.14 214.37,99.5 213.35,99.5 SV16.3
  Bottom 0.203: v235.81,83.55 235.81,83.76 232.56,87.01 v224.94,87.01
28027_SDA  (via drill 0.51)
  Top 0.203: v239.37,82.33 238.86,81.83 237.84,81.83 U11.14 | v226.77,100.82 225.44,102.15 R35.2 225.34,102.15 224.12,100.93 218.23,100.93 216.91,99.61 215.89,99.61 SV16.5
  Bottom 0.203: v239.37,82.33 239.37,88.12 226.77,100.72 v226.77,100.82
28027_SPICLKA
  Top 0.203: U11.32 229.61,77.25 230.42,77.25 231.13,76.54 231.13,72.78 228.7,70.34 227.99,70.34 J38.P$1
28027_SPISIMOA
  Top 0.203: U11.35 229.61,75.22 230.52,75.22 230.73,75.02 230.73,72.99 229.2,71.46 227.58,71.46 226.56,70.45 226.56,69.94 225.85,69.23 223.92,69.23 222.9,70.24 J36.P$1
28027_SPISOMIA
  Top 0.203: U11.34 229.51,75.93 227.68,75.93 225.44,73.7 225.44,70.34 J35.P$1
28027_SPISTEA
  Top 0.203: J37.P$1 226.56,76.54 229.51,76.54 U11.33
+3.3V  (via drill 0.51)
  Top 0.356: U11.22 220.34,83.76 C13.1 | U11.4 245.26,75.31 247.01,75.31 C21.1
  Top 0.559: U5.P$8 165.86,28.41 C6.1
  Top 0.61: U2.16 52.7,101.43 52.7,102.7 55.87,102.7 C12.1 | U4.16 80,88.58 C14.1 | U12.P$4 33.65,17.62
  Top 0.66: U3.8 205.94,56.45 208.27,56.45 C4.1 | IC4.14 14.62,14.92 16.5,14.92 C5.1
  Top 0.864: U12.P$5 U12.P$4 | 33.65,17.62 33.65,22.06 34.92,22.06 C23.1
  Top 1.27: v6.09,10.2 4.77,11.52 4.46,11.52 R2.1 | v7.51,11.62 9.44,11.62 R3.1 | 14.62,14.92 14.62,12.64 | 14.62,12.64 14.62,11.62 R4.1 15.23,11.62 19.6,11.62 R5.1 20.31,11.62 24.68,11.62 R6.1 | 14.62,12.64 v12.9,12.64 | SV75.1 SV75.3 SV75.5 | v33.12,22.49 33.32,22.29 33.65,22.06 | 70,13.25 70,3.49 71.01,2.48 73.76,2.48 74.26,2.98 74.26,5.32 72.64,6.95 72.44,6.95 R19.2 73.35,7.05 75.48,9.18 v92.04,9.18 | 70,13.25 71.42,14.67 72.33,14.67 R20.2 | 98.55,12.94 98.55,10.4 96.21,8.07 96.21,7.35 R24.2 | 98.55,12.94 97.12,14.36 96.21,14.36 R23.2 | J123.P$3 123.84,13.86 123.84,16.29 J123.P$2 123.84,16.9 123.84,18.83 J123.P$1 123.84,19.44 123.84,21.37 U$1.1 124.35,21.78 128.11,25.54 v153.41,25.54 | v99.77,13.04 99.16,13.04 98.55,12.94 | v57.6,20.56 62.48,20.56 69.49,13.55 70,13.25 | SV10.2 161.64,107.73 161.64,107.53 159.1,104.99 155.34,104.99 R17.2 154.73,104.79 128.01,104.79 122.42,99.2 J177.P$3 | R18.2 172.61,105.19 172.82,105.19 174.34,106.72 174.34,109.16 171.5,112 163.37,112 161.74,110.38 SV30.2 | L1.P$41 J177.P$1 J177.P$2 J177.P$3 | SV19.2 102.31,103.26 102.31,103.06 104.34,101.03 119.58,101.03 121.41,99.2 J177.P$3 | v97.63,99.81 87.57,89.75 80.26,89.75 C14.1 | v57.6,102.25 56.08,102.25 C12.1 | SV15.5 254,108.44 255.11,109.56 255.11,111.59 C11.1 R8.1 | v239.97,109.56 239.97,105.4 R38.2 | v245.26,75.22 245.26,75.31 | v245.26,90.46 251.25,96.46 R37.2 251.66,97.07 251.66,100.11 R36.2 252.27,100.22 v254.61,102.55 | v261.82,101.94 v261.82,110.58 | v180.64,31.03 166.11,31.03 C6.1 | ETH1.P$10 199.44,12.54 199.44,10 ETH1.P$11 200.04,9.89 214.47,9.89 218.54,5.83 220.87,5.83 221.38,6.34 221.38,20.77 v218.84,23.3
  Top 1.27: 205.94,56.45 205.94,52.56 R25.2 | v209.19,55 208.48,55.72 208.48,56.22 C4.1 | v213.76,50.43 213.76,35.19 216.91,32.04 216.91,27.57 215.28,25.95 SV11.1 215.18,25.23 215.18,23.41 SV11.2 | J10.P$3 J10.P$2 J10.P$1 L1.P$1 186.02,91.17 189.58,91.17 v203.5,77.25 v203.5,65.27 | v225.14,93.92 224.02,95.03 222.4,95.03 R34.1 222.3,94.42 222.3,93.61 v221.79,93.1 | 225.14,98.59 225.14,99.1 225.34,99.3 R35.1 | 225.14,98.59 v225.14,97.68 | v210.51,107.43 210.51,111.09 209.6,112 203.19,112 201.57,110.38 201.37,110.38 SV26.4 | v220.06,86.7 220.06,85.38 220.26,85.18 C13.1 | v204.41,58.36 204.41,56.73 U3.8 | 225.14,98.59 v230.32,98.59 | v182.88,101.43 v179.42,104.89
  Bottom 1.27: v6.09,10.2 v7.51,11.62 8.12,11.72 11.98,11.72 v12.9,12.64 13.51,12.74 23.16,12.74 32.61,22.19 v33.12,22.49 42.46,31.84 SV75.1 | J123.P$3 123.74,13.75 123.03,13.04 v99.77,13.04 99.26,12.74 95.7,9.18 v92.04,9.18 | v57.6,20.56 48.66,29.5 48.66,31.84 SV75.5 | SV30.2 161.64,110.27 161.64,107.84 SV10.2 162.15,107.43 164.69,104.89 v179.42,104.89 | SV19.2 102.2,103.26 100.68,101.74 99.56,101.74 v97.63,99.81 97.02,99.71 89.3,99.71 87.78,98.18 67.86,98.18 63.8,102.25 v57.6,102.25 | SV18.4 229.31,110.38 230.93,112 237.54,112 v239.97,109.56 240.48,109.87 241.19,110.58 252.27,110.58 254,108.85 | 254,108.85 SV15.5 | U15.P$3 241.5,61.51 241.5,61.3 242.92,59.88 247.19,59.88 248.1,60.8 248.1,67.7 245.26,70.55 v245.26,75.22 v245.26,90.46 245.16,91.07 245.16,91.68 241.9,94.93 233.98,94.93 v230.32,98.59 | v261.82,110.58 260.8,111.59 257.25,111.59 254.61,108.95 254,108.85 | v261.82,101.94 261.21,102.55 v254.61,102.55 | ETH1.P$10 199.33,12.54 197.71,14.16 197.71,20.97 186.13,32.55 182.16,32.55 v180.64,31.03 180.13,30.72 174.95,25.54 v153.41,25.54 | v213.76,50.43 v209.19,55 | v225.14,97.68 v225.14,93.92 | v210.51,107.43 210.51,104.08 209.19,102.76 209.19,97.57 215.49,91.27 | v220.06,86.7 217.72,89.04 | 217.72,89.04 215.49,91.27 | 217.72,89.04 v221.79,93.1 | v203.5,77.25 210.1,83.86 210.1,85.89 215.49,91.27 | v204.41,58.36 204.41,64.35 v203.5,65.27 | v218.84,23.3 215.28,23.3 SV11.2 | J10.P$3 v182.88,101.43
+5V  (via drill 0.51)
  Top 0.61: U9.14 33.65,68.03 C32.1 | U7.14 49.91,68.03 C31.1 | U8.14 49.91,52.79 49.91,53.48 C30.1 | U10.14 33.65,52.79 C33.1 | IC2.24 75.56,47.59 75.56,50.63 74.29,50.63 C34.1
  Top 0.864: U12.P$2 U12.P$1 38.73,22.7 38.09,22.7 C22.1
  Top 1.27: U12.P$1 38.91,17.21 43.17,12.94 R33.2 43.78,11.62 51.71,11.62 P3.P$2 | SV45.1 SV45.3 SV45.5 56.59,32.35 57.91,33.67 57.91,35.09 54.96,38.04 24.78,38.04 20.92,41.9 v20.42,42.2 20.42,46.16 C49.1 | C47.1 17.77,31.74 20.42,31.74 C48.1 19.7,31.13 v19.7,30.01 | SV21.7 13.91,35.5 11.48,35.5 SV21.8 11.07,36.01 9.75,37.33 9.75,49.11 10.97,50.33 SV28.8 11.37,50.84 11.37,51.04 9.75,52.67 9.75,61.81 11.37,63.44 SV23.8 11.07,63.95 9.75,65.27 9.75,74.51 10.97,75.73 SV24.8 11.48,76.14 13.41,76.14 SV24.7 14.02,76.24 14.12,76.34 16.76,76.34 C39.1 17.47,76.34 19.91,76.34 C40.1 20.52,76.03 27.83,76.03 33.52,70.34 C32.1 34.23,70.24 43.68,70.24 45.82,72.38 56.28,72.38 59.33,69.33 59.33,68.01 58.41,67.09 52.93,67.09 52.32,66.99 | C38.1 19.91,61.71 17.47,61.71 C37.1 16.86,62.01 15.44,62.01 14.02,63.44 SV23.7 | L1.P$61 J152.P$1 J152.P$2 J152.P$3 122.02,80.5 122.02,76.95 v129.84,69.13 | 52.32,53.48 57.7,53.48 QG1.14 | 52.32,53.48 49.91,53.48 | v45.41,53.99 33.93,53.99 C33.1 | 52.32,66.99 51.3,68.01 50.18,68.01 U7.14 | 52.32,53.48 52.32,66.99 | 74.16,51.45 74.16,50.84 C34.1 | v73.35,52.26 74.16,51.45 | v94.08,71.16 74.67,51.75 74.16,51.45 | SV26.3 201.37,107.73 201.57,107.73 203.4,105.9 214.68,105.9 216.5,107.73 SV17.3 216.5,108.34 216.5,110.27 SV17.4 | 195.22,101.69 190.8,106.11 190.29,106.11 188.67,107.73 SV25.3 188.56,108.34 188.56,110.27 SV25.4 | 195.22,101.69 v211.63,85.28 | v242.72,104.69 245.36,102.04 v249.52,102.04 | v249.52,68.21 249.52,67.09 246.58,64.15 IC3.1 | 195.22,101.69 v197.71,104.18 | R22.2 325.12,21.78 325.12,16.5 R21.2 325.42,15.99 327.15,14.26 329.99,14.26 SV12.2 330.6,14.16 333.04,14.16 SV9.2 333.75,14.26 335.58,14.26 SV8.2
  Top 1.27: v199.44,55.51 199.44,61.71 198.42,62.73 198.42,68.11 J103.P$1 J103.P$2 J103.P$3 L1.P$21 | v253.59,43.22 v301.44,43.22 | v232.35,55 231.85,55 231.75,54.9 230.32,54.9 228.8,56.43 IC3.13
  Bottom 1.27: P3.P$2 59.13,13.25 59.13,21.17 56.28,24.02 56.28,31.84 SV45.5 | v20.42,42.2 20.42,42 14.02,35.6 SV21.7 14.42,35.29 v19.7,30.01 | SV23.7 13.91,63.44 11.48,63.44 SV23.8 | v45.41,53.99 57.2,53.99 57.7,53.48 QG1.14 58.21,52.97 59.33,51.85 66.34,51.85 66.75,52.26 v73.35,52.26 | J152.P$3 121.71,81.11 111.75,71.16 v94.08,71.16 | v211.63,85.28 224.23,72.68 237.54,72.68 246.07,64.15 246.48,64.15 IC3.1 | v242.72,104.69 232.56,104.69 229.51,107.73 229.31,107.73 SV18.3 | v249.52,68.21 v249.52,102.04 | v197.71,104.18 201.26,107.73 SV26.3 | v199.44,55.51 200.86,55.51 207.97,48.4 229.1,48.4 230.32,49.62 230.32,50.84 228.8,52.36 228.8,56.43 IC3.13 | v301.44,43.22 330.5,14.16 SV12.2 | v253.59,43.22 248.71,43.22 242.21,49.72 237.64,49.72 v232.35,55 | L1.P$21 185.62,88.73 188.56,91.68 188.56,107.73 SV25.3 | v129.84,69.13 178.71,69.13 179.83,68.01 181.05,68.01 185.41,72.38 J103.P$1
ADCA0
  Top 0.203: U11.21 229.51,84.47 228.59,84.47 220.77,92.29 220.77,97.17 218.44,99.5 SV16.7
ADCA2
  Top 0.203: U11.20 229.51,85.08 229.51,90.97 220.97,99.5 SV16.9
ADCA4
  Top 0.203: U11.19 237.84,85.08 237.84,95.14 238.45,95.74 238.45,96.76 231.44,103.77 222.5,103.77 222.19,104.08 220.37,104.08 218.44,102.15 SV16.8
ADCA6  (via drill 0.51)
  Top 0.203: v221.89,103.26 221.99,103.36 231.24,103.36 238.04,96.56 238.04,95.95 236.62,94.53 236.62,84.77 236.93,84.47 237.74,84.47 U11.18
  Bottom 0.203: v221.89,103.26 211.93,103.26 210.81,102.15 SV16.2
ADCB2  (via drill 0.51)
  Top 0.203: v219.04,92.29 219.04,81.32 219.25,81.11 221.38,81.11 222.7,82.44 229.51,82.44 U11.24
  Bottom 0.203: v219.04,92.29 219.04,98.59 219.86,99.4 219.86,100.93 220.97,102.04 SV16.10
ADCB4
  Top 0.203: U11.25 229.51,81.72 222.6,81.72 221.58,80.71 219.04,80.71 212.24,87.52 212.24,100.01 213.15,100.93 214.78,100.93 215.89,102.04 SV16.6
ADCIN14
  Top 0.61: J105.P$1 J105.P$2 J105.P$3 L1.P$23
ADCIN15
  Top 0.61: J150.P$3 J150.P$2 J150.P$1 L1.P$63
ADCINA2
  Top 0.61: J111.P$1 J111.P$2 J111.P$3 L1.P$29
ADCINA3
  Top 0.61: J108.P$1 J108.P$2 J108.P$3 L1.P$26
ADCINA4
  Top 0.61: J144.P$3 J144.P$2 J144.P$1 L1.P$69
ADCINA5
  Top 0.61: J147.P$3 J147.P$2 J147.P$1 L1.P$66
ADCINB2
  Top 0.61: J110.P$1 J110.P$2 J110.P$3 L1.P$28
ADCINB3
  Top 0.61: J107.P$1 J107.P$2 J107.P$3 L1.P$25
ADCINB4
  Top 0.203: L1.P$68 103.02,89.85 101.49,89.85 100.48,90.87 100.48,99.1 97.23,102.35 97.23,103.26 SV19.4
  Top 0.61: J145.P$3 J145.P$2 J145.P$1 L1.P$68
ADCINB5
  Top 0.61: J148.P$3 J148.P$2 J148.P$1 L1.P$65
ADCINC2  (via drill 0.51)
  Top 0.203: v229,50.23 234.79,56.02 234.79,56.33 238.86,60.39 238.86,61.51 U15.P$4 | v192.12,56.53 174.64,74 v174.64,76.64
  Top 0.61: L1.P$27 J109.P$3 J109.P$2 J109.P$1
  Bottom 0.203: v229,50.23 219.96,50.23 219.15,49.42 208.38,49.42 201.26,56.53 v192.12,56.53 | J109.P$1 v174.64,76.64
ADCINC3
  Top 0.203: L1.P$24 178.91,89.85 178.91,99 180.33,100.42 186.02,100.42 186.94,99.5 186.94,97.98 215.69,69.23 220.47,69.23 221.48,68.21 221.48,67.6 222.4,66.69 222.5,66.69 224.63,64.55 224.63,64.25 225.75,63.13 233.78,63.13 235.3,61.61 236.32,61.61 U15.P$5
  Top 0.61: J106.P$1 J106.P$2 J106.P$3 L1.P$24
ADCINC4  (via drill 0.51)
  Top 0.203: v227.48,57.75 231.24,61.51 U15.P$7 | v181.45,80.1 v196.79,64.76
  Top 0.61: J146.P$2 J146.P$3 | J146.P$1 L1.P$67
  Bottom 0.203: v227.48,57.75 205.23,57.75 204.82,57.34 204.01,57.34 202.69,58.66 202.69,58.87 v196.79,64.76 | v181.45,80.1 181.45,86.6 180.44,87.62 179.93,87.62 178.91,88.63 178.91,89.14 177.9,90.16 177.39,90.16 176.37,91.17 176.37,91.68 175.36,92.7 174.85,92.7 173.83,93.71 173.83,94.22 173.12,94.93 132.18,94.93 122.32,85.08 107.79,85.08 107.74,85.13 | J146.P$1 107.74,85.13 | J146.P$2 106.67,84.06 107.74,85.13
ADCINC5  (via drill 0.51)
  Top 0.203: v220.67,60.49 226.66,60.49 227.68,61.51 228.7,61.51 U15.P$8 | v192.53,66.08 185.41,66.08 v175.66,75.83
  Top 0.61: L1.P$64 J149.P$1 J149.P$2
  Bottom 0.203: v220.67,60.49 220.47,60.49 214.27,66.69 202.89,66.69 202.48,67.09 193.54,67.09 v192.53,66.08 | v175.66,75.83 128.72,75.83 122.32,82.23 115.41,82.23 115.36,82.18 | J149.P$3 115.36,82.18 | J149.P$2 114.29,83.25 115.36,82.18
ADXRS300_3V3
  Top 0.203: 241.7,43.02 241.7,43.93 R10.2 | 241.7,43.02 241.7,41.19 R9.1 | 241.7,43.02 J1.P$1 J1.P$2
DACOUTA
  Top 0.61: J112.P$1 J112.P$2 J112.P$3 L1.P$30
DACOUTB
  Top 0.61: J143.P$3 J143.P$2 J143.P$1 L1.P$70
EQEP1A  (via drill 0.51)
  Top 0.203: v29.66,28.99 19.3,28.99 17.06,26.76 10.97,26.76 10.36,27.37 10.36,28.39 10.97,28.99 11.58,28.99 12.49,29.91 12.49,30.52 13.91,31.94 13.91,32.96 SV21.5 | v80.36,50.33 82.19,50.33 82.49,50.63 J3.P$1 J3.P$2
  Bottom 0.203: v29.66,28.99 29.97,28.99 43.68,42.71 61.77,42.71 64.92,45.86 75.89,45.86 v80.36,50.33
EQEP1B  (via drill 0.51)
  Top 0.203: v31.39,47.08 v23.87,47.08 | J6.P$1 J6.P$2
  Bottom 0.203: v23.87,47.08 14.93,38.14 14.02,38.14 SV21.9 | v31.39,47.08 35.35,47.08 48.36,60.08 75.58,60.08 82.49,53.18 J6.P$1
EQEP2A
  Top 0.203: J2.P$1 J2.P$2
  Bottom 0.203: SV21.6 11.37,33.06 11.37,33.97 8.33,37.02 8.33,77.15 11.37,80.2 41.65,80.2 52.22,69.63 78.73,69.63 82.49,65.88 J2.P$1
EQEP2B
  Top 0.203: J5.P$1 J5.P$2
  Bottom 0.203: SV21.10 11.48,38.04 11.48,37.02 12.49,36.01 12.49,32.45 11.88,31.84 10.97,31.84 7.92,34.89 7.92,77.36 11.98,81.42 62.28,81.42 73.66,70.04 80.87,70.04 82.49,68.41 J5.P$1
EQEP3A_5V  (via drill 0.51)
  Top 0.203: v72.54,37.43 IC2.16 | v37.59,35.5 25.7,35.5 14.12,47.08 12.59,47.08 11.48,48.2 SV28.6
  Bottom 0.203: v72.54,37.43 69.39,37.43 65.12,33.16 59.02,33.16 56.69,35.5 v37.59,35.5
EQEP3B_5V  (via drill 0.51)
  Top 0.203: v72.54,34.89 IC2.14 | v62.07,32.35 55.37,39.05 29.76,39.05 21.03,47.79 18.49,47.79 14.12,52.16 12.59,52.16 11.48,53.28 SV28.10
  Bottom 0.203: v72.54,34.89 67.46,34.89 64.92,32.35 v62.07,32.35
GND  (via drill 0.51)
  Top 0.356: C28.2 300.22,107.52 U6.25 292.73,107.52 | U6.26 292.73,108.17 292.73,107.52 | 292.73,107.52 292.73,105.57 | 292.73,104.92 292.73,102.97 U6.18 | 292.73,105.57 U6.7 284.98,105.57 C26.2 | 292.73,105.57 292.73,104.92 | U6.21 292.73,104.92 | C13.2 220.34,83.11 U11.23 231.85,83.11 234.31,83.11 234.31,80.51 | U11.3 234.31,74.66 | 234.31,74.66 234.31,80.51 | U11.2 234.59,74.01 234.31,74.01 234.31,74.66 | U11.12 234.31,80.51
  Top 0.508: U5.P$4 163.06,24.6 C6.2
  Top 0.61: U4.15 75.56,91.64 C14.2 | U2.15 55.87,100.16 C12.2
  Top 0.66: U9.3 30.85,65.49 C32.2 | U7.3 47.11,65.49 C31.2 | U10.3 30.85,50.25 C33.2 | U8.3 47.11,50.25 C30.2 | IC2.13 71.49,33.62 | 71.49,33.62 71.49,47.59 | 71.49,47.59 C34.2 | IC2.1 71.49,47.59 | IC2.12 71.49,33.62 | U3.4 200.65,59.52 208.27,59.52 C4.2 | IC4.7 5.84,17.93 11.48,17.93 C5.2
  Top 0.864: U12.P$3 35.33,7.46 U12.P$6
  Top 1.27: L1.P$60 J153.P$1 J153.P$2 J153.P$3 121.81,37.33 v121.81,34.07 | J124.P$3 126.38,13.86 126.38,16.29 J124.P$2 126.38,16.9 126.38,18.83 J124.P$1 126.38,19.44 126.38,21.37 U$1.2 | 76.7,3.8 SV68.2 SV68.1 | 76.7,3.8 SV68.3 | 81.78,3.8 SV69.2 SV69.1 | 81.78,3.8 SV69.3 | 81.78,3.8 76.7,3.8 | 86.86,3.8 SV70.2 SV70.1 | 86.86,3.8 SV70.3 | 91.94,3.8 SV71.2 SV71.1 | 91.94,3.8 SV71.3 | 91.94,3.8 86.86,3.8 | 86.86,3.8 81.78,3.8 | U12.P$6 35.66,7.25 40.33,2.58 43.17,2.58 LED6.C 43.78,2.68 54.96,2.68 60.95,8.67 P3.P$1 | 44.8,56.63 32.51,56.63 30.98,55.11 C33.2 30.27,55 28.75,55 22.45,61.3 | 44.8,56.63 45,56.63 46.83,54.8 C30.2 | SV24.2 11.48,68.52 13.91,68.52 SV24.1 14.52,68.31 16.25,68.31 22.85,61.71 | C39.2 17.47,73.49 19.91,73.49 C40.2 20.11,72.88 20.11,71.56 26.21,65.47 | C37.2 17.47,58.97 19.91,58.97 C38.2 20.42,59.27 22.45,61.3 | 22.85,61.71 23.57,62.42 23.57,62.83 26.21,65.47 | 22.85,61.71 22.45,61.3 | 26.21,65.47 27.22,65.47 U9.3 | C22.2 38.09,25.44 34.94,25.44 C23.2 34.84,26.05 34.84,27.16 34.44,27.57 34.44,28.79 | 34.44,28.79 40.02,34.38 SV75.2 SV75.4 SV75.6 SV45.2 SV45.4 SV45.6 | C49.2 20.42,49.01 20.42,49.42 14.02,55.82 SV23.1 13.41,55.82 11.48,55.82 SV23.2 | C47.2 17.77,34.58 20.42,34.58 C48.2 21.03,34.28 26.31,34.28 31.69,28.89 33.83,28.89 34.44,28.79 | C47.2 17.27,34.18 15.64,32.55 15.64,29.6 14.02,27.98 SV21.1 13.41,27.88 11.48,27.88 SV21.2 | SV28.2 11.48,43.12 11.48,42.91 17.67,36.72 17.67,35.19 C47.2 | v11.48,19.24 11.48,17.93 | C10.2 38.7,93.51 35.35,93.51 34.54,94.32 34.54,98.59 C7.1 34.84,99.2 34.23,99.2 33.22,100.22 33.22,104.69 35.05,106.52 X1.G2 35.66,106.21 36.57,105.3 42.06,105.3 X1.5
  Top 1.27: 85.44,107.43 v100.68,107.43 | SV3.5 85.44,107.43 | 71.11,108.65 69.59,107.12 69.59,105.3 C18.2 | SV6.5 71.11,108.65 | C15.1 77.82,105.3 77.82,105.9 76.3,107.43 72.54,107.43 71.62,108.34 71.11,108.65 | SV1.2 60.45,95.74 57.91,95.74 SV1.1 57.6,96.25 55.98,97.88 55.98,99.91 C12.2 56.48,100.62 58.11,100.62 60.14,102.65 X1.G1 | C34.2 71.32,50.74 65.42,56.63 65.42,68.62 QG1.7 66.03,68.72 70,68.72 80.77,79.49 SV27.2 SV27.1 80.77,82.74 76.91,86.6 76.19,86.6 75.69,87.11 75.69,88.33 U4.15 | v47.24,65.47 47.11,65.49 | J151.P$3 J151.P$2 J151.P$1 L1.P$62 | 85.44,107.43 85.34,106.82 85.34,97.07 80.16,91.88 C14.2 | v44.8,58.05 44.8,56.63 | U15.P$11 226.16,58.97 226.16,56.53 IC3.12 226.46,55.92 226.46,55.31 227.88,53.89 227.88,51.04 227.68,50.84 227.68,46.88 | 227.68,46.88 231.24,46.88 R14.1 231.85,46.88 236.42,46.88 R12.1 237.03,46.57 v239.26,44.34 | 227.68,46.88 226.06,46.88 R16.1 | L1.P$22 J104.P$3 J104.P$2 J104.P$1 182.98,80.5 182.98,80 v196.9,66.08 | J102.P$1 J102.P$2 J102.P$3 L1.P$20 185.92,45.86 186.13,46.06 202.38,46.06 210.71,54.39 210.71,57.34 210,58.05 | 210,58.05 209.6,58.46 209.49,58.46 208.58,59.37 C4.2 | v199.94,64.45 199.94,63.34 200.45,62.83 U3.4 | 210,58.05 v210.92,58.97 | 163.06,24.6 163.16,24.42 163.16,21.48 175.25,9.39 B3.P$1 175.87,9.18 180.94,9.18 186.74,3.39 195.27,3.39 199.33,7.46 ETH1.P$12 | SV11.4 212.75,23.41 212.75,25.85 SV11.3 | SV4.2 248.2,34.79 245.76,34.79 SV4.1 245.36,34.28 244.14,33.06 244.14,16.8 | SV22.2 248.2,17.01 245.76,17.01 SV22.1 245.16,16.8 244.14,16.8 | 244.14,16.8 243.53,16.8 236.21,9.49 P2.P$1 | SV5.26 325.12,60.19 322.57,60.19 SV5.25 322.27,60.69 320.95,62.01 320.95,78.78 322.17,80 SV5.9 322.57,80.5 325.12,80.5 SV5.10
  Top 1.27: 321.36,96.86 316.88,96.86 C27.2 | 321.36,96.86 322.57,98.08 C24.2 | C25.2 326.33,101.84 326.33,96.96 325.12,95.74 J7.P$1 | v321.76,96.46 321.36,96.86 | C28.2 300.32,107.23 302.76,107.23 C29.2 302.87,107.84 302.87,109.05 305.4,111.59 USB_PWR1.K 305.81,111.09 306.93,109.97 306.93,109.56 310.59,105.9 316.17,105.9 X2.GND | SV2.5 327.65,85.58 330.19,85.58 SV2.6 330.6,85.08 331.82,83.86 331.82,77.25 330.5,75.93 SV2.14 | SV2.19 327.65,67.8 330.19,67.8 SV2.20 | SV2.13 327.65,75.42 330.19,75.42 SV2.14 | SV2.20 330.5,68.31 331.82,69.63 331.82,73.7 330.6,74.92 SV2.14 | SV12.1 330.6,11.62 333.04,11.62 SV9.1 333.75,11.72 335.58,11.72 SV8.1 335.99,12.13 337.31,13.45 337.31,34.18 331.21,40.27 330.91,40.78 | SV2.29 327.65,55.11 330.19,55.11 SV2.30 | SV5.39 322.57,42.41 325.12,42.41 SV5.40 325.62,42 326.84,40.78 330.91,40.78 | SV2.33 327.65,50.02 330.19,50.02 SV2.34 | 330.91,40.78 331.82,41.69 331.82,48.3 330.6,49.52 SV2.34 | SV2.30 330.6,54.6 331.82,53.38 331.82,51.85 330.5,50.53 SV2.34 | SV2.20 330.6,67.3 331.82,66.08 331.82,56.93 330.5,55.61 SV2.30 | 234.59,70.55 228.8,64.76 228.8,64.15 IC3.8 | 234.59,74.01 234.59,70.55 | C20.2 250.24,76.85 250.24,79.69 C19.2 | C21.2 247.09,77.46 249.63,77.46 C20.2 | 243.53,46.88 243.63,46.88 248.2,51.45 248.2,57.34 246.48,59.07 | 243.53,46.88 241.7,46.88 R10.1 | 246.48,59.07 244.04,61.51 U15.P$2 | 251.96,70.45 251.96,64.55 246.48,59.07 | 251.96,70.45 251.96,75.12 250.64,76.44 C20.2 | 251.96,70.45 235.2,70.45 234.59,70.55 | SV25.2 186.02,110.27 186.02,107.84 SV25.1 186.53,107.43 191.31,102.65 v192.12,102.65 | SV26.1 198.72,107.84 198.72,110.27 SV26.2
  Top 1.27: SV16.1 210.81,99.61 207.06,99.61 199.23,107.43 SV26.1 | SV15.12 246.38,105.9 248.92,105.9 SV15.10 249.52,105.9 251.45,105.9 SV15.8 251.96,105.5 253.18,104.28 255.82,104.28 R7.2 256.43,103.36 256.43,105.7 256.53,105.8 SV15.4 | v259.48,110.07 257.96,111.59 C11.2 | SV17.1 213.96,107.84 213.96,110.27 SV17.2 | SV18.1 226.66,107.84 226.66,110.27 SV18.2 | v192.63,106.41 192.93,106.11 197.1,106.11 198.32,107.33 SV26.1 | 231.85,83.11 231.85,100.11 P1.2 | v283.15,103.26 284.88,104.99 C26.2 | v243.53,46.27 243.53,46.88
  Bottom 1.27: J124.P$3 126.28,13.75 120.7,8.17 109.93,8.17 B1.P$2 109.32,8.37 107.59,8.37 106.06,9.89 98.55,9.89 96.31,7.66 91.94,7.66 SV71.1 | v121.81,34.07 121.81,27.37 126.28,22.9 126.28,21.48 U$1.2 | SV68.1 76.7,7.66 61.97,7.66 60.95,8.67 P3.P$1 60.65,9.28 60.65,30.01 56.28,34.38 SV45.6 | v11.48,19.24 11.48,27.88 SV21.2 | SV28.2 11.37,43.22 9.75,44.84 9.75,53.99 11.37,55.61 11.37,55.82 SV23.2 11.07,56.33 9.34,58.05 9.34,66.89 10.97,68.52 11.37,68.52 SV24.2 | v100.68,107.43 SV19.1 105.35,103.57 154.94,103.57 158.69,107.33 SV10.1 159.1,107.84 159.1,110.27 SV30.1 159.61,110.68 160.93,112 184.4,112 186.02,110.38 SV25.2 | SV3.6 SV3.5 83.31,108.75 81.99,107.43 72.94,107.43 71.62,108.75 SV6.5 70.91,109.05 68.37,106.52 X1.G1 59.53,106.41 56.69,103.57 44.19,103.57 42.56,105.19 42.16,105.19 X1.5 | QG1.7 65.32,68.62 62.17,65.47 v47.24,65.47 46.93,64.96 44.8,62.83 v44.8,58.05 | J151.P$3 119.17,81.11 117.55,79.49 81.58,79.49 81.27,79.79 SV27.2 | v196.9,66.08 198.32,66.08 v199.94,64.45 | v210.92,58.97 226.16,58.97 U15.P$11 | ETH1.P$12 ETH1.P$1 219.76,8.07 219.76,10 ETH1.P$2 220.06,10.5 221.38,11.82 | 221.38,11.82 221.38,20.77 220.37,21.78 219.04,21.78 218.94,21.68 214.57,21.68 212.95,23.3 212.75,23.3 SV11.4 | 221.38,11.82 221.99,11.72 233.27,11.72 236.21,8.78 P2.P$1 | SV4.1 245.66,34.79 239.26,41.19 v239.26,44.34 239.87,44.44 241.7,44.44 v243.53,46.27 | v321.76,96.46 324.4,96.46 325.12,95.74 J7.P$1 325.62,95.34 328.67,92.29 330.91,92.29 331.82,91.38 331.82,87.21 330.19,85.58 SV2.6 | v321.76,96.46 321.25,96.76 315.67,102.35 315.56,102.35 314.65,103.26 314.65,104.58 315.87,105.8 316.17,105.8 X2.GND
  Bottom 1.27: SV5.9 322.57,80.71 320.95,82.33 320.95,95.24 321.56,95.85 v321.76,96.46 | v259.48,110.07 260.19,110.07 260.7,109.56 260.7,105.19 | 260.7,105.19 259.79,104.28 258.06,104.28 256.53,105.8 SV15.4 | 231.75,102.76 231.75,100.22 P1.2 | 231.75,102.76 226.77,107.73 SV18.1 | SV18.2 226.66,110.38 225.04,112 215.89,112 214.27,110.38 214.07,110.38 SV17.2 213.56,110.78 212.34,112 200.65,112 199.03,110.38 198.83,110.38 SV26.2 | SV15.12 246.38,105.8 246.07,105.8 243.12,102.86 232.35,102.86 231.75,102.76 | v192.12,102.65 192.12,105.9 v192.63,106.41 | v283.15,103.26 275.13,103.26 271.06,99.2 266.69,99.2 260.7,105.19
  pour Top: -0.01,-0.17 339.08,-0.17 339.08,114.13 -0.01,114.13
  pour Bottom: -0.01,-0.17 -0.01,114.13 339.08,114.13 339.08,-0.17
GPIO0
  Top 0.61: L1.P$40 J122.P$1 J122.P$2 J122.P$3
  Bottom 0.203: J122.P$3 185.41,61.2 203.7,79.49 203.7,84.57 196.29,91.99 196.29,107.73 SV25.9
GPIO1
  Top 0.61: L1.P$39 J121.P$1 J121.P$2 J121.P$3
  Bottom 0.203: J121.P$3 182.88,63.13 193.64,73.9 193.64,107.73 SV25.7
GPIO2
  Top 0.61: L1.P$38 J120.P$1 J120.P$2 J120.P$3
  Bottom 0.203: J120.P$3 180.33,61.2 191.1,71.97 191.1,107.73 SV25.5
GPIO3
  Top 0.61: L1.P$37 J119.P$1 J119.P$2 J119.P$3
  Bottom 0.203: J119.P$3 178.91,54.6 183.28,54.6 183.99,55.31 183.99,56.12 183.69,56.43 183.69,63.34 194.76,74.41 194.76,107.94 196.19,109.36 196.19,110.27 SV25.10
GPIO4
  Top 0.61: L1.P$36 J118.P$1 J118.P$2 J118.P$3
  Bottom 0.203: J118.P$3 175.87,56.33 175.87,57.34 189.68,71.16 189.68,107.94 190.6,108.85 191.21,108.85 192.63,110.27 193.64,110.27 SV25.8
GPIO5
  Top 0.203: J117.P$3 173.83,56.83 173.83,100.72 184.5,111.39 189.07,111.39 190.09,110.38 191.1,110.38 SV25.6
  Top 0.61: L1.P$35 J117.P$1 J117.P$2 J117.P$3
GPIO6
  Top 0.203: J133.P$3 120.8,56.83 118.97,56.83 116.73,59.07 100.88,59.07 97.94,56.12 97.94,50.33 86.35,38.75 75.28,38.75 IC2.17
  Top 0.61: L1.P$80 J133.P$1 J133.P$2 J133.P$3
GPIO7
  Top 0.203: L1.P$79 118.26,46.98 98.44,46.98 87.68,36.21 75.28,36.21 IC2.15
  Top 0.61: J134.P$3 J134.P$2 J134.P$1 L1.P$79
GPIO8  (via drill 0.51)
  Top 0.203: v202.89,84.27 v204.92,86.3 | v174.64,61.91 v184.5,61.91 | v116.43,58.26 116.43,56.12 J135.P$3
  Top 0.61: L1.P$78 J135.P$1 J135.P$2 J135.P$3
  Bottom 0.203: v204.92,86.3 204.92,99.91 208.88,103.87 208.88,107.73 SV26.9 | v202.89,84.27 202.89,80.3 v184.5,61.91 | v174.64,61.91 120.09,61.91 v116.43,58.26
GPIO9  (via drill 0.51)
  Top 0.203: v128.82,66.18 128.82,66.69 162.15,100.01 169.67,100.01 181.45,111.8 198.83,111.8 199.84,110.78 199.84,110.17 200.76,109.26 203.91,109.26 205.33,107.84 206.34,107.84 SV26.7
  Top 0.61: L1.P$77 J136.P$1 J136.P$2 J136.P$3
  Bottom 0.203: v128.82,66.18 120.7,66.18 110.64,56.12 110.64,55.31 111.35,54.6 113.18,54.6 J136.P$3
GPIO10  (via drill 0.51)
  Top 0.203: v203.81,91.17 203.81,86.8 v202.08,85.08 | v174.64,63.03 v184.5,63.03
  Top 0.61: L1.P$76 J137.P$1 J137.P$2 J137.P$3
  Bottom 0.203: v203.81,91.17 203.81,107.73 SV26.5 | v202.08,85.08 202.08,80.61 v184.5,63.03 | v174.64,63.03 119.07,63.03 J137.P$3
GPIO11
  Top 0.61: L1.P$75 J138.P$1 J138.P$2 J138.P$3
GPIO14  (via drill 0.51)
  Top 0.203: SV4.9 245.76,24.62 245.76,27.06 SV4.7 | v240.99,24.52 218.84,2.38 133.09,2.38 v109.72,25.74
  Top 0.61: L1.P$74 J139.P$1 J139.P$2 J139.P$3
  Bottom 0.203: v240.99,24.52 245.66,24.52 SV4.9 | v109.72,25.74 109.72,33.36 105.56,37.53 105.56,43.42 106.57,44.44 107.08,44.44 107.79,45.15 107.79,46.37 106.67,47.48 L1.P$74
GPIO15  (via drill 0.51)
  Top 0.203: SV4.11 245.76,21.98 245.76,19.55 SV4.13 245.76,19.44 246.78,19.44 248.1,18.12 248.71,18.12 249.42,17.41 249.42,14.06 248.41,13.04 247.9,13.04 246.88,12.03 246.88,11.52 245.87,10.5 241.6,10.5 233.06,1.97 132.38,1.97 v108.6,25.74
  Top 0.61: L1.P$73 J140.P$1 J140.P$2 J140.P$3
  Bottom 0.203: v108.6,25.74 108.6,31.94 103.02,37.53 103.02,46.98 L1.P$73
GPIO16  (via drill 0.51)
  Top 0.203: v147.62,47.38 129.74,29.5 100.07,29.5 94.79,24.22 33.93,24.22 32.1,26.05 30.78,26.05 SV41.1
  Top 0.61: J115.P$3 J115.P$2 J115.P$1 L1.P$33
  Bottom 0.203: v147.62,47.38 161.23,47.38 161.64,46.98 166.52,46.98 L1.P$33
GPIO18  (via drill 0.51)
  Top 0.203: v201.87,58.46 201.87,56.53 U3.6 | v194.15,66.18 180.33,80 177.39,80 176.68,80.71 176.68,90.16 L1.P$4
  Top 0.61: J16.P$3 J16.P$2 J16.P$1 L1.P$4
  Bottom 0.203: v194.15,66.18 v201.87,58.46
GPIO19
  Top 0.203: J15.P$3 181.45,100.01 185.82,100.01 186.53,99.3 186.53,97.78 204.52,79.79 204.52,62.62 U3.1
  Top 0.61: L1.P$3 J15.P$1 J15.P$2 J15.P$3
GPIO22
  Top 0.203: L1.P$8 166.52,90.16 166.52,65.16 130.45,29.1 100.27,29.1 94.99,23.81 33.73,23.81 32.81,24.73 30.17,24.73 28.85,26.05 28.24,26.05 SV41.3
  Top 0.61: J20.P$3 J20.P$2 J20.P$1 L1.P$8
GPIO24
  Top 0.203: J9.P$2 207.66,33.57 207.66,36.01 J9.P$1
  Top 0.61: L1.P$34 J116.P$1 J116.P$2 J116.P$3
  Bottom 0.203: L1.P$34 171.29,46.98 195.68,46.98 206.55,36.11 207.56,36.11 J9.P$1
GPIO25  (via drill 0.51)
  Top 0.203: v70.4,38.65 67.86,41.19 65.22,41.19 IC2.6 | v85.74,35.4 96.51,35.4 J162.P$3
  Top 0.61: L1.P$51 J162.P$1 J162.P$2 J162.P$3
  Bottom 0.203: v70.4,38.65 82.49,38.65 v85.74,35.4
GPIO26  (via drill 0.51)
  Top 0.203: v63.49,43.32 63.9,43.73 65.12,43.73 IC2.4 | v63.49,33.97 63.49,33.47 64,32.96 99.16,32.96 J160.P$3
  Top 0.61: L1.P$53 J160.P$1 J160.P$2 J160.P$3
  Bottom 0.203: v63.49,33.97 v63.49,43.32
GPIO27
  Top 0.203: J11.P$2 207.66,18.33 207.66,20.77 J11.P$1
  Top 0.61: J161.P$3 J161.P$2 J161.P$1 L1.P$52
  Bottom 0.203: J161.P$3 101.59,20.77 90.82,10 90.82,6.74 91.13,6.44 110.03,6.44 110.64,7.05 122.42,7.05 125.57,3.9 191.41,3.9 198.62,11.11 199.54,11.11 206.65,18.23 207.56,18.23 J11.P$2
GPIO29
  Top 0.203: J29.P$1 164.48,36.01 182.88,36.01 186.53,32.35 205.53,32.35 206.24,33.06 206.24,36.21 212.75,42.71 212.75,55.21 220.37,62.83 220.37,67.7 J37.P$2
  Top 0.61: L1.P$11 J29.P$3 J29.P$2 J29.P$1
GPIO32  (via drill 0.51)